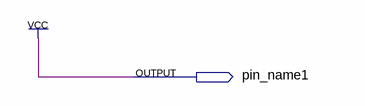
[diagram p0: schematic sheet]
// Quartus schematic bpv.bdf as structural Verilog: 0 symbols, 1 pins
module bpv (
  output pin_name1
);


  assign pin_name1 = 1'b1;
endmodule
